# Altium project Core board.PrjPcb
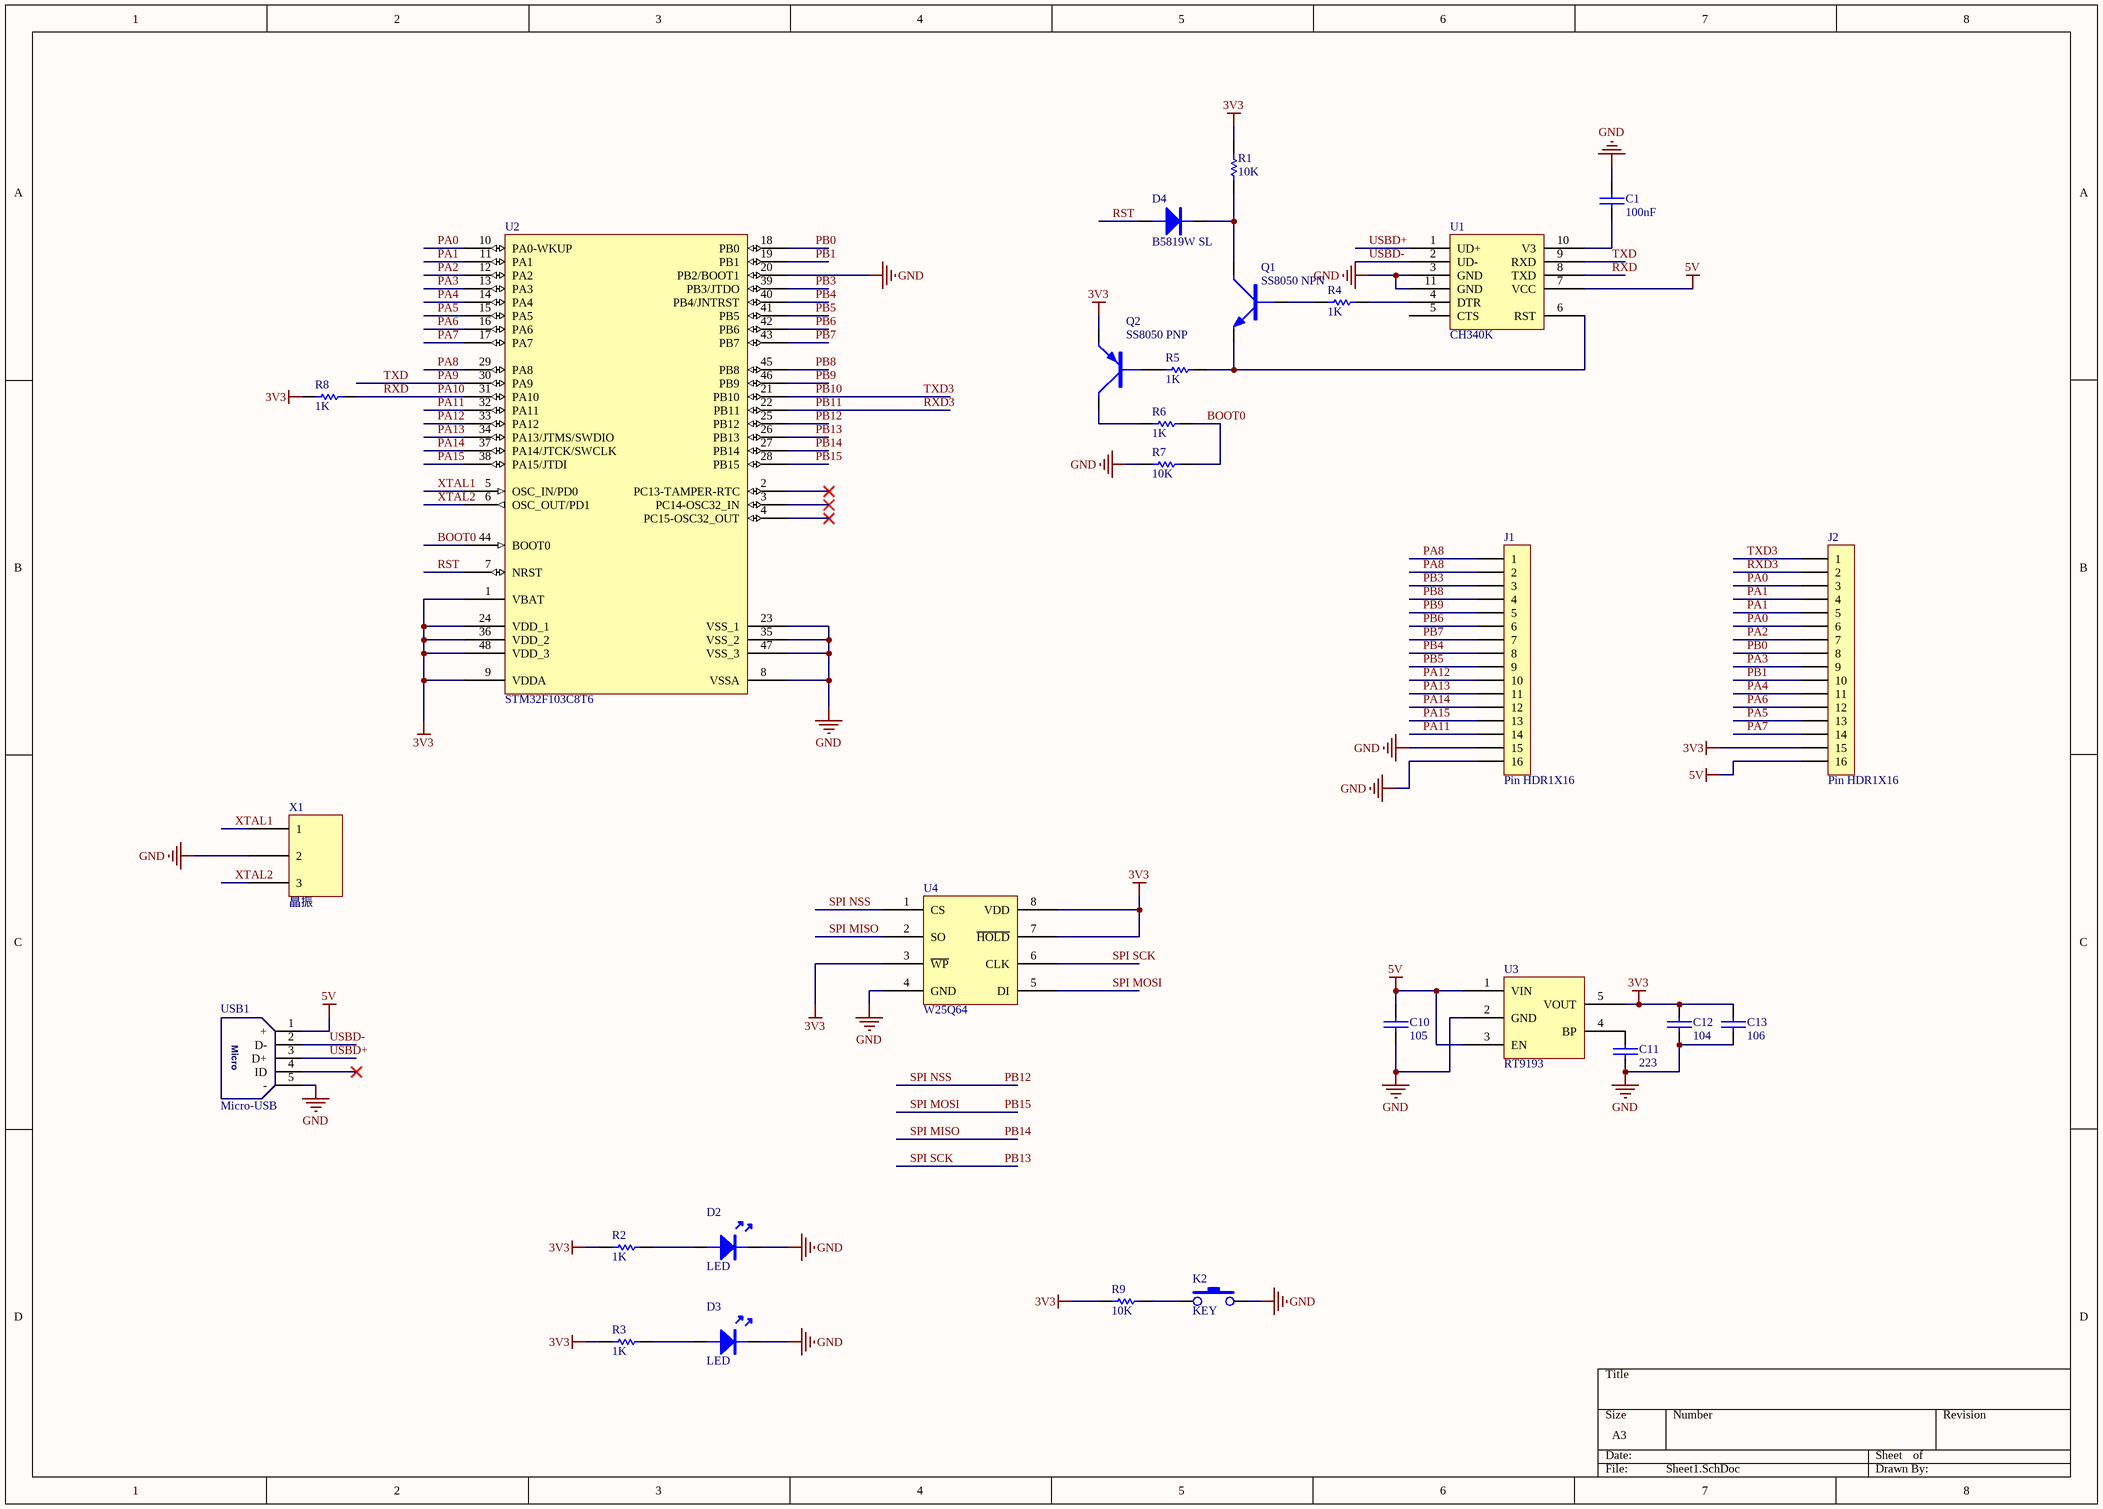
[diagram p0: Sheet1.SchDoc]
1 sheet, 28 parts. Net scope: global (net labels, ports and power ports of the same name join across sheets).
Board file: PCB1.PcbDoc

## Sheet Sheet1.SchDoc
size A3; SheetNumber: 1; SheetTotal: 1

### Parts
C1  100nF  [0603C]
C10  105  [0603C]
C11  223  [0603C]
C12  104  [0603C]
C13  106  [0603C]
D2  LED  [LED-0603G]
D3  LED  [LED-0603G]
D4  B5819W SL  [SOD-123]
J1  Pin HDR1X16  [Pin HDR1X16/2.54mm-S]
J2  Pin HDR1X16  [Pin HDR1X16/2.54mm-S]
K2  KEY  [SMD-3X6X2.5]
Q1  SS8050 NPN  [SOT-23]
Q2  SS8050 PNP  [SOT-23]
R1  10K  [0603R]
R2  1K  [0603R]
R3  1K  [0603R]
R4  1K  [0603R]
R5  1K  [0603R]
R6  1K  [0603R]
R7  10K  [0603R]
R8  1K  [0603R]
R9  10K  [0603R]
U1  CH340K  [ESSOP-10]
U2  STM32F103C8T6  [LQFP48 7X7]
U3  RT9193  [RT9193-33GB]
U4  W25Q64  [SOIC-8]
USB1  Micro-USB  [USB-micro_B]
X1  晶振  [8MHZ]

### Nets
3V3: C12.2 C13.2 J2.15 Q2.E R1.2 R2.1 R3.1 R8.1 R9.1 U2.1(VBAT) U2.9(VDDA) U2.24(VDD_1) U2.36(VDD_2) U2.48(VDD_3) U3.5(VOUT) U4.3(~{WP}) U4.7(~{HOLD}) U4.8(VDD)
5V: C10.2 J2.16 U1.7(VCC) U3.1(VIN) U3.3(EN) USB1.1(+)
GND: C1.2 C10.1 C11.1 C12.1 C13.1 D2.K D3.K J1.15 J1.16 K2.3 R7.2 U1.3(GND) U1.11(GND) U2.8(VSSA) U2.20(PB2/BOOT1) U2.23(VSS_1) U2.35(VSS_2) U2.47(VSS_3) U3.2(GND) U4.4(GND) USB1.5(-) X1.2
BOOT0: R6.2 R7.1 U2.44(BOOT0)
PA0: J2.3 J2.6 U2.10(PA0-WKUP)
PA1: J2.4 J2.5 U2.11(PA1)
PA2: J2.7 U2.12(PA2)
PA3: J2.9 U2.13(PA3)
PA4: J2.11 U2.14(PA4)
PA5: J2.13 U2.15(PA5)
PA6: J2.12 U2.16(PA6)
PA7: J2.14 U2.17(PA7)
PA8: J1.1 J1.2 U2.29(PA8)
PA9: U1.9(RXD) U2.30(PA9)  [also labelled TXD]
PA10: R8.2 U1.8(TXD) U2.31(PA10)  [also labelled RXD]
PA11: J1.14 U2.32(PA11)
PA12: J1.10 U2.33(PA12)
PA13: J1.11 U2.34(PA13/JTMS/SWDIO)
PA14: J1.12 U2.37(PA14/JTCK/SWCLK)
PA15: J1.13 U2.38(PA15/JTDI)
PB0: J2.8 U2.18(PB0)
PB1: J2.10 U2.19(PB1)
PB3: J1.3 U2.39(PB3/JTDO)
PB4: J1.8 U2.40(PB4/JNTRST)
PB5: J1.9 U2.41(PB5)
PB6: J1.6 U2.42(PB6)
PB7: J1.7 U2.43(PB7)
PB8: J1.4 U2.45(PB8)
PB9: J1.5 U2.46(PB9)
PB10: J2.1 U2.21(PB10)  [also labelled TXD3]
PB11: J2.2 U2.22(PB11)  [also labelled RXD3]
PB12: U2.25(PB12) U4.1(CS)  [also labelled SPI NSS]
PB13: U2.26(PB13) U4.6(CLK)  [also labelled SPI SCK]
PB14: U2.27(PB14) U4.2(SO)  [also labelled SPI MISO]
PB15: U2.28(PB15) U4.5(DI)  [also labelled SPI MOSI]
RST: D4.A U2.7(NRST)
USBD+: U1.1(UD+) USB1.3(D+)
USBD-: U1.2(UD-) USB1.2(D-)
XTAL1: U2.5(OSC_IN/PD0) X1.1
XTAL2: U2.6(OSC_OUT/PD1) X1.3
NetC1_1: C1.1 U1.10(V3)
NetC11_2: C11.2 U3.4(BP)
NetD2_A: D2.A R2.2
NetD3_A: D3.A R3.2
NetD4_K: D4.K Q1.C R1.1
NetK2_1: K2.1 R9.2
NetQ1_B: Q1.B R4.1
NetQ1_E: Q1.E R5.2 U1.6(RST)
NetQ2_B: Q2.B R5.1
NetQ2_C: Q2.C R6.1
NetR4_2: R4.2 U1.4(DTR)

Not connected (* = marked no-connect by the designer): U1 5(CTS); U2 2(PC13-TAMPER-RTC)* 3(PC14-OSC32_IN)* 4(PC15-OSC32_OUT)*; USB1 4(ID)*

### Notes on the sheet
- (in symbol Micro-USB) Micro

### Library data of the parts
C1 C10-C13 = CAP: 无极性电容
D4 = DIODE: 普通二极管
Q1 = NPN: NPN三极管
Q2 = PNP: PNP三极管
R1-R9 = RES
X1 = 8MHZ